# Altium schematic sheet middleManBoard.SchDoc
size A; SheetNumber: 4; SheetTotal: 3
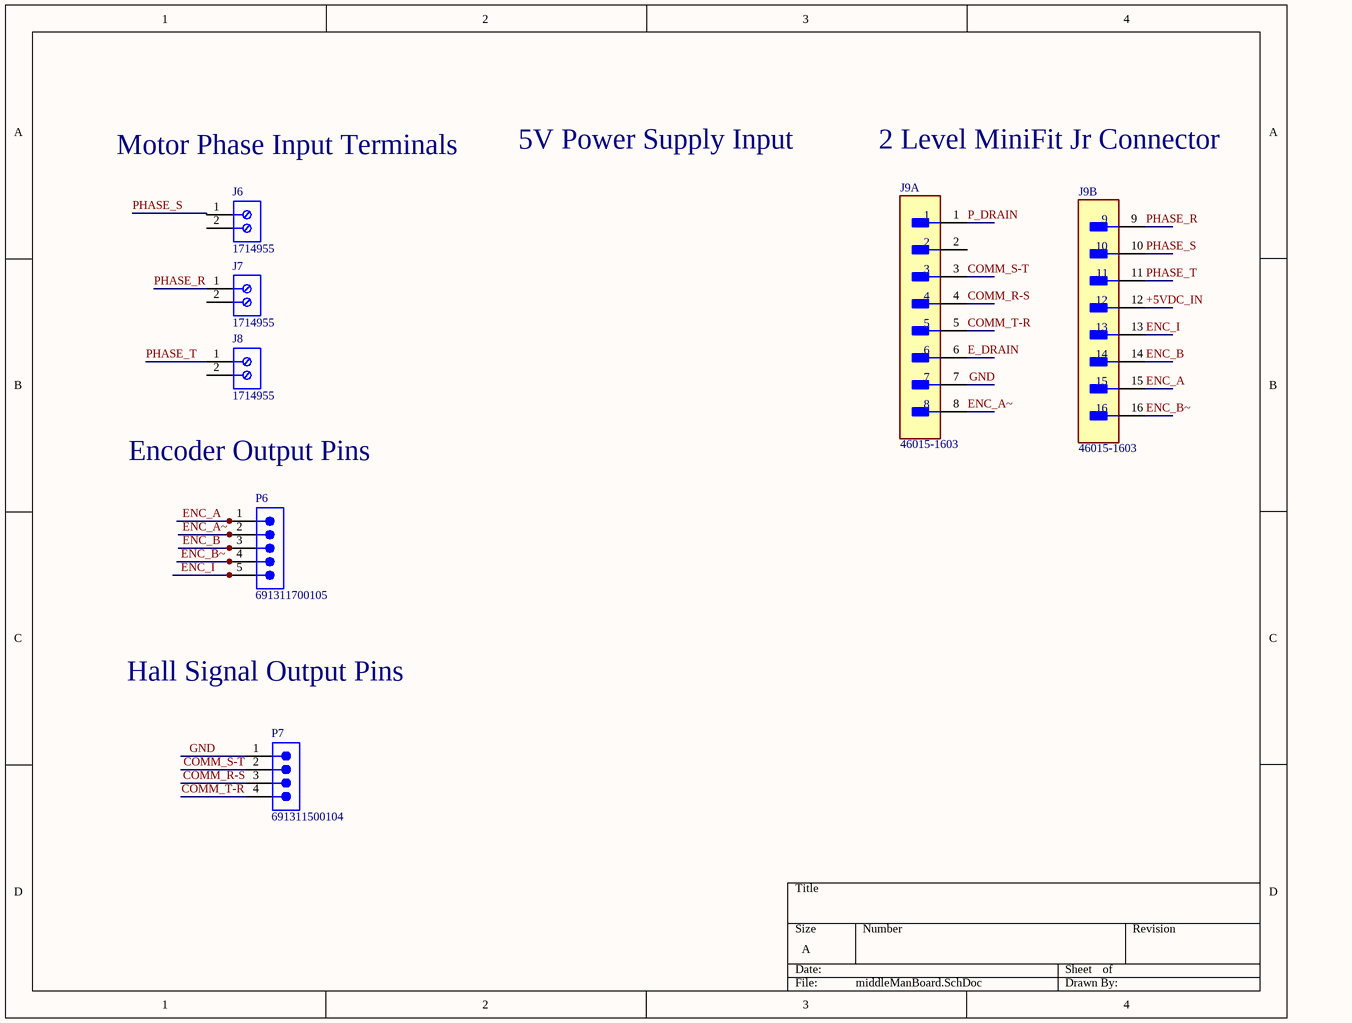
[diagram p0: middleManBoard.SchDoc]

## Parts
J6  1714955  [PHOE-1714955_V]
J7  1714955  [PHOE-1714955_V]
J8  1714955  [PHOE-1714955_V]
J9  46015-1603  [FP-46015-1603-MFG]  (parts A,B of 2)
P6  691311700105  [691311700105]
P7  691311500104  [691311500104]

## Nets
+5VDC_IN: J9.12
COMM_R-S: J9.4 P7.3
COMM_S-T: J9.3 P7.2
COMM_T-R: J9.5 P7.4
E_DRAIN: J9.6
ENC_A: J9.15 P6.1
ENC_A~: J9.8 P6.2
ENC_B: J9.14 P6.3
ENC_B~: J9.16 P6.4
ENC_I: J9.13 P6.5
GND: J9.7 P7.1
P_DRAIN: J9.1
PHASE_R: J7.1 J9.9
PHASE_S: J6.1 J9.10
PHASE_T: J8.1 J9.11

Not connected (* = marked no-connect by the designer): J6 2; J7 2; J8 2; J9 2

## Notes on the sheet
- (near J6) Motor Phase Input Terminals
- 5V Power Supply Input
- 2 Level MiniFit Jr Connector
- Encoder Output Pins
- Hall Signal Output Pins

## Library data of the parts
J6-J8 = CMP-2000-05797-1: PC Terminal Block, Pitch 6.35 mm, 1 x 2 Position, Height 21.5 mm, Tail Lenght 5.1 mm, RoHS, Bulk; Manufacturer: Phoenix Contact; Package Description: PC Terminal Block, Pitch 6.35 mm, 1 x 2 Position, Height 21.5 mm, Tail Lenght 5.1 mm; Datasheet URL: http://media.digikey.com/pdf/Data%20Sheets/Phoenix%20Contact%20PDFs/1714955.pdf; Package Reference: 1714955; Manufacturer URL: http://www.phoenixcontact.com/; Datasheet Version: 02/2010; Mounting Technology: ThroughHole
J9 = CMP-04776-001032-1: CONN HEADER VERT 16POS 4.2MM; Number of Circuits: 16; Current Rating: 13A; Glow Wire Compliant: Non-compliant; Voltage Rating: 600V; Orientation: Vertical; Package Quantity: 1920; Series: 46015; Contact Gender: Male; Contact Material: Copper Alloy; Radiation Hardening: No; Termination: Through Hole; Row Spacing: 4.2mm; Number of Contacts: 16; RoHS Compliant: Yes; Number of Rows: 2; Contact Plating: Tin; Weight: 0.119967oz; Housing Material: Nylon; Pitch: 4.2mm; Halogen Free: Low Halogen; Reach SVHC Compliant: Yes; Packaging: Tray; Number of Positions: 16
P6 = CMP-1502-02036-2: NexarPartId: 18818313; Current: 20A; Number of Positions Per Level: 5; Connector Type: PCB, Terminal Block; Gender: Male; Voltage: 300V; Number of Levels: 1; Pitch: 5.0038mm; Mount: Through Hole; Length: 8.5mm; Contact Material: Brass; Height: 12mm; REACH SVHC: Unknown; Termination: Solder; Number of Contacts: 5; Packaging: Box; Orientation: Vertical; Color: Green; RoHS: Compliant; Lead Pitch: 5mm; Number of Pins: 5; Number of Rows: 1; Width: 27mm
P7 = CMP-1502-02148-2: NexarPartId: 8917749; Pitch: 5.08mm; Number of Positions Per Level: 4; Gender: Male; Voltage: 300V; Current: 20A; Number of Levels: 1; Orientation: Vertical; Number of Pins: 4; Mount: Through Hole; Number of Contacts: 4; Length: 8.5mm; Number of Rows: 1; Contact Plating: Tin; Color: Green; Termination: Solder; Contact Material: Brass; REACH SVHC: Unknown; RoHS: Compliant; Lead Pitch: 5.08mm; Width: 22.32mm; Height: 12mm; Packaging: Box